# EAGLE design in-14driver (EAGLE 9.5.2)
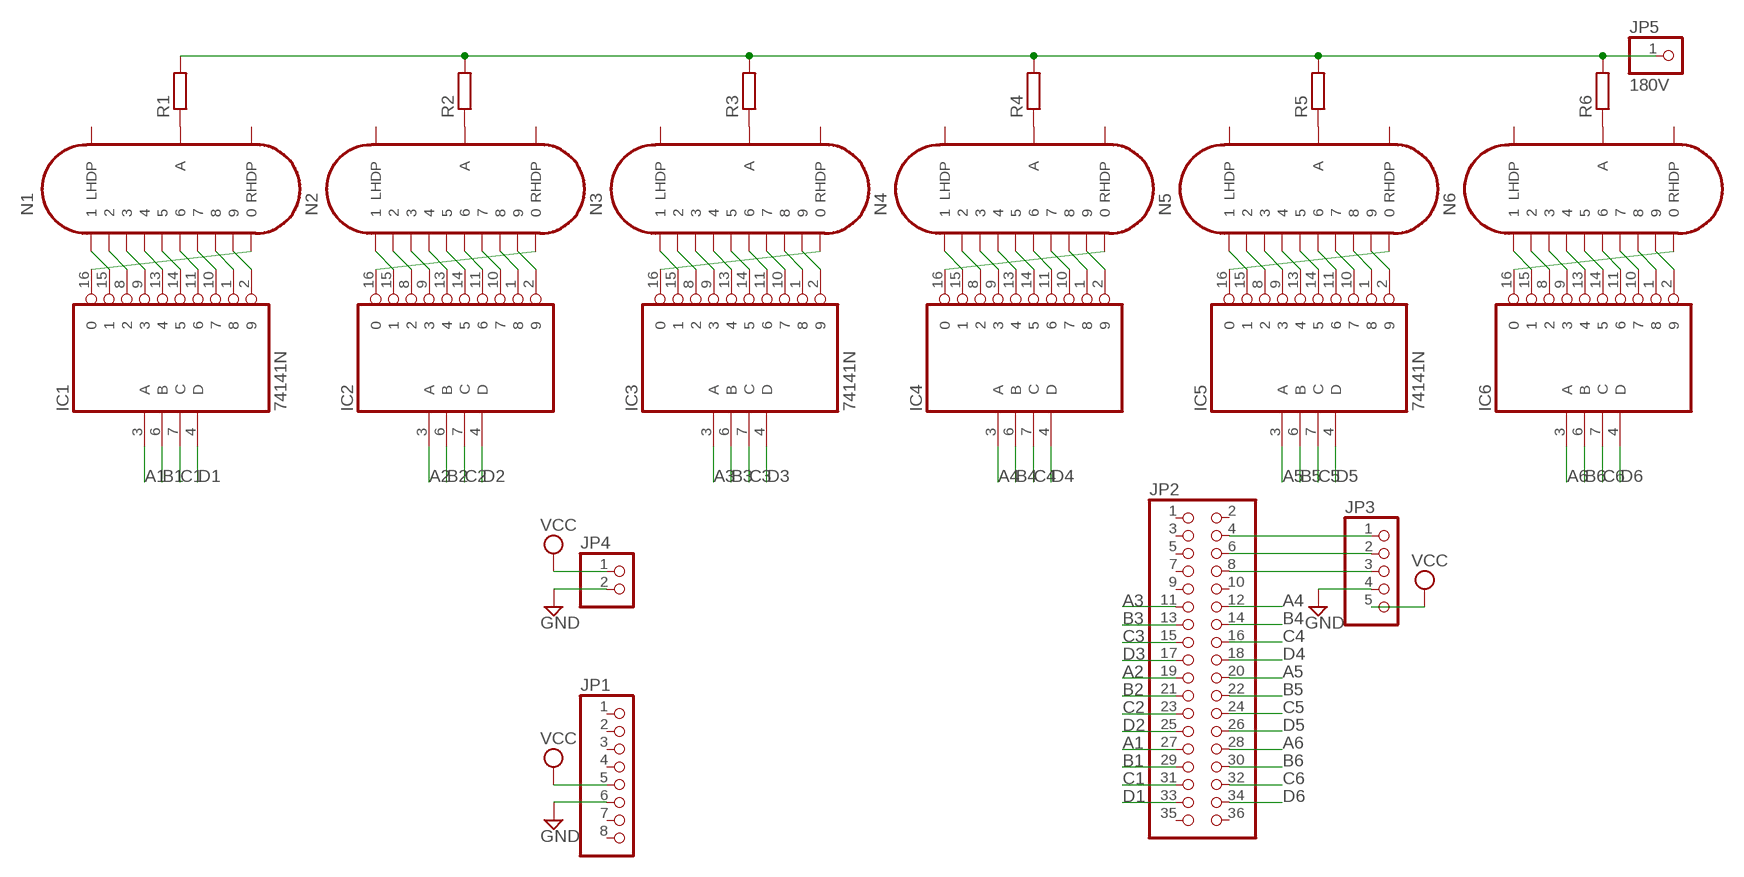
[diagram p0: schematic, sheet 1]

## Parts
IC1  74141N  [DIL16]
IC2  74141N  [DIL16]
IC3  74141N  [DIL16]
IC4  74141N  [DIL16]
IC5  74141N  [DIL16]
IC6  74141N  [DIL16]
JP1  PINHD-1X8  [1X08]
JP2  PINHD-2X18  [2X18]
JP3  PINHD-1X5  [1X05]
JP4  PINHD-1X2  [1X02]
JP5  180V  PINHD-1X1  [1X01]
N1  IN-14  [IN-14]
N2  IN-14  [IN-14]
N3  IN-14  [IN-14]
N4  IN-14  [IN-14]
N5  IN-14  [IN-14]
N6  IN-14  [IN-14]
R1  R-EU_0207/10  [0207/10]
R2  R-EU_0207/10  [0207/10]
R3  R-EU_0207/10  [0207/10]
R4  R-EU_0207/10  [0207/10]
R5  R-EU_0207/10  [0207/10]
R6  R-EU_0207/10  [0207/10]

## Nets
A1: IC1.3(A) JP2.27
A2: IC2.3(A) JP2.19
A3: IC3.3(A) JP2.11
A4: IC4.3(A) JP2.12
A5: IC5.3(A) JP2.20
A6: IC6.3(A) JP2.28
B1: IC1.6(B) JP2.29
B2: IC2.6(B) JP2.21
B3: IC3.6(B) JP2.13
B4: IC4.6(B) JP2.14
B5: IC5.6(B) JP2.22
B6: IC6.6(B) JP2.30
C1: IC1.7(C) JP2.31
C2: IC2.7(C) JP2.23
C3: IC3.7(C) JP2.15
C4: IC4.7(C) JP2.16
C5: IC5.7(C) JP2.24
C6: IC6.7(C) JP2.32
D1: IC1.4(D) JP2.33
D2: IC2.4(D) JP2.25
D3: IC3.4(D) JP2.17
D4: IC4.4(D) JP2.18
D5: IC5.4(D) JP2.26
D6: IC6.4(D) JP2.34
GND: JP1.6 JP3.4 JP4.2
N$1: IC2.15 N2.0
N$2: IC2.8 N2.9
N$3: IC2.9 N2.8
N$4: IC2.13 N2.7
N$5: IC2.14 N2.6
N$6: IC2.11 N2.5
N$7: IC2.10 N2.4
N$8: IC2.1 N2.3
N$9: IC2.2 N2.2
N$10: IC2.16 N2.1
N$11: N2.A R2.1
N$12: IC3.15 N3.0
N$13: IC3.8 N3.9
N$14: IC3.9 N3.8
N$15: IC3.13 N3.7
N$16: IC3.14 N3.6
N$17: IC3.11 N3.5
N$18: IC3.10 N3.4
N$19: IC3.1 N3.3
N$20: IC3.2 N3.2
N$21: JP2.4 JP3.1
N$22: JP2.6 JP3.2
N$23: JP2.8 JP3.3
N$29: IC3.16 N3.1
N$30: N3.A R3.1
N$31: IC4.15 N4.0
N$32: IC4.8 N4.9
N$33: IC4.9 N4.8
N$34: IC4.13 N4.7
N$35: IC4.14 N4.6
N$36: IC4.11 N4.5
N$37: IC4.10 N4.4
N$38: IC4.1 N4.3
N$39: IC4.2 N4.2
N$40: IC4.16 N4.1
N$41: N4.A R4.1
N$42: IC5.15 N5.0
N$43: IC5.8 N5.9
N$44: IC5.9 N5.8
N$45: IC5.13 N5.7
N$46: IC5.14 N5.6
N$47: IC5.11 N5.5
N$48: IC5.10 N5.4
N$57: IC1.15 N1.0
N$58: IC1.8 N1.9
N$59: IC1.9 N1.8
N$60: IC1.13 N1.7
N$61: IC1.14 N1.6
N$62: IC1.11 N1.5
N$63: IC1.10 N1.4
N$64: IC1.1 N1.3
N$65: IC1.2 N1.2
N$66: IC1.16 N1.1
N$67: IC5.1 N5.3
N$68: IC5.2 N5.2
N$69: IC5.16 N5.1
N$70: N5.A R5.1
N$71: IC6.15 N6.0
N$72: IC6.8 N6.9
N$73: IC6.9 N6.8
N$74: IC6.13 N6.7
N$75: IC6.14 N6.6
N$76: IC6.11 N6.5
N$94: N1.A R1.1
N$95: IC6.10 N6.4
N$96: IC6.1 N6.3
N$97: IC6.2 N6.2
N$98: IC6.16 N6.1
N$99: N6.A R6.1
VCC: JP1.5 JP3.5 JP4.1
VH: JP5.1 R1.2 R2.2 R3.2 R4.2 R5.2 R6.2
Unconnected: JP1.1 JP1.2 JP1.3 JP1.4 JP1.7 JP1.8 JP2.1 JP2.2 JP2.3 JP2.5 JP2.7 JP2.9 JP2.10 JP2.35 JP2.36 N1.LHDP N1.RHDP N2.LHDP N2.RHDP N3.LHDP N3.RHDP N4.LHDP N4.RHDP N5.LHDP N5.RHDP N6.LHDP N6.RHDP

## Power pins joined to a net without a drawn wire
GND: IC1.12(GND) IC2.12(GND) IC3.12(GND) IC4.12(GND) IC5.12(GND) IC6.12(GND)
VCC: IC1.5(VCC) IC2.5(VCC) IC3.5(VCC) IC4.5(VCC) IC5.5(VCC) IC6.5(VCC)

## Library data of the parts
IC1-IC6 = 74xx-us:74*141: BCD to decimal DECODER/DRIVER
JP1 = pinhead:PINHD-1X8: PIN HEADER
JP2 = pinhead:PINHD-2X18: PIN HEADER
JP3 = pinhead:PINHD-1X5: PIN HEADER
JP4 = pinhead:PINHD-1X2: PIN HEADER
JP5 = pinhead:PINHD-1X1: PIN HEADER
N1-N6 = russian-nixies:IN-14: IN-14: medium numeric frontview nixie tube
R1-R6 = rcl:R-EU_: RESISTOR, European symbol; SPICEPREFIX: R

## Board
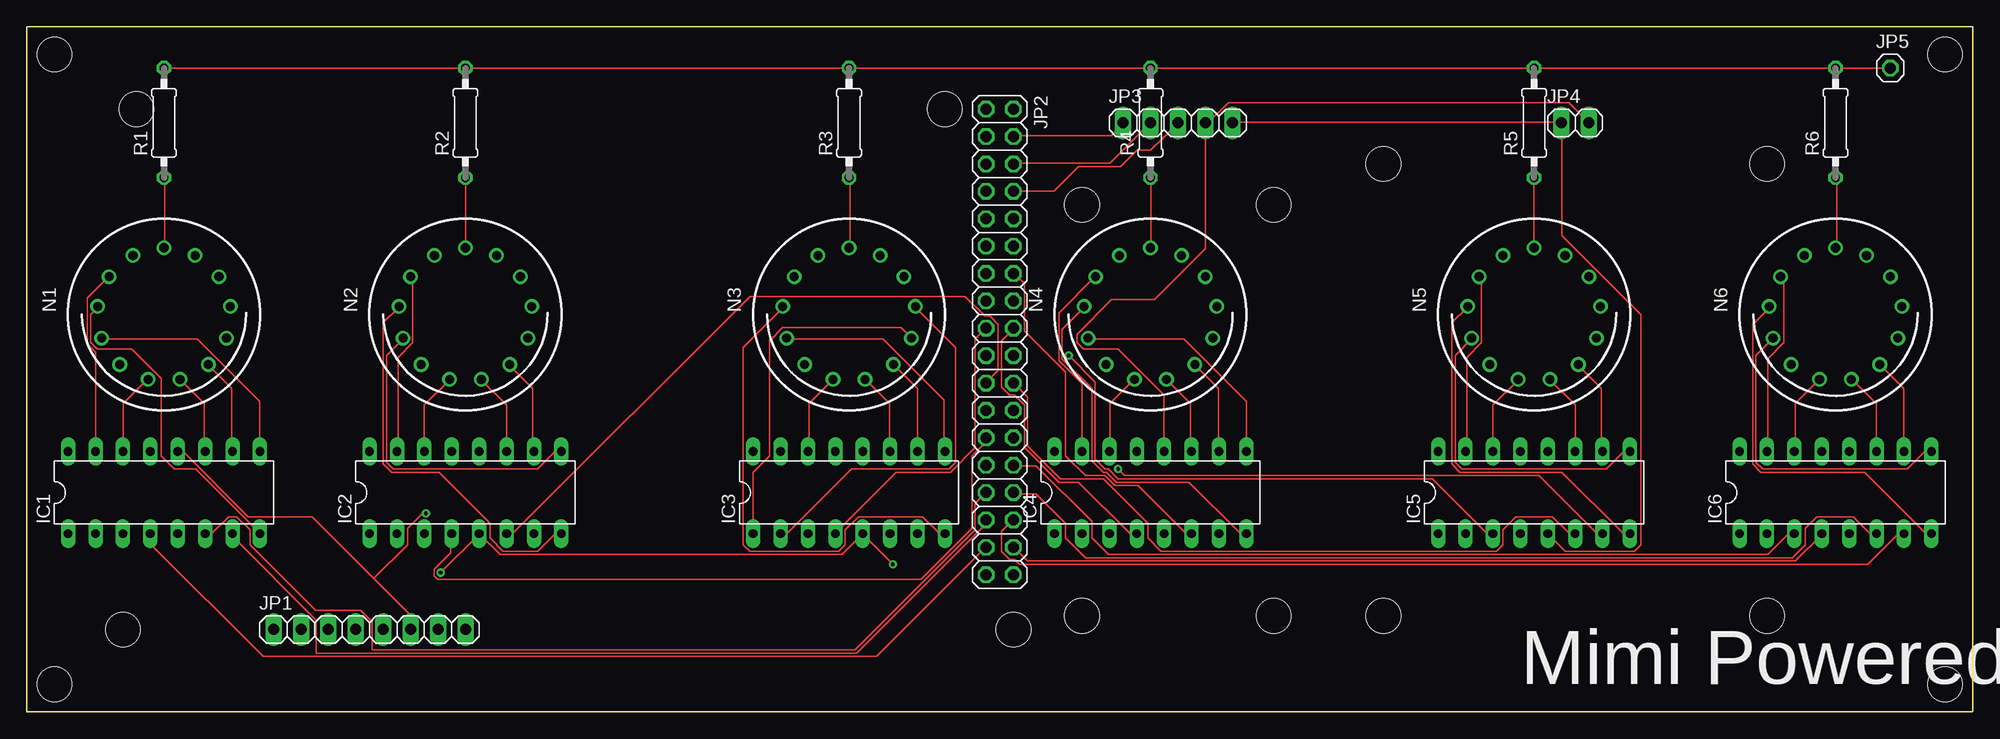
[diagram p1: board, top side]
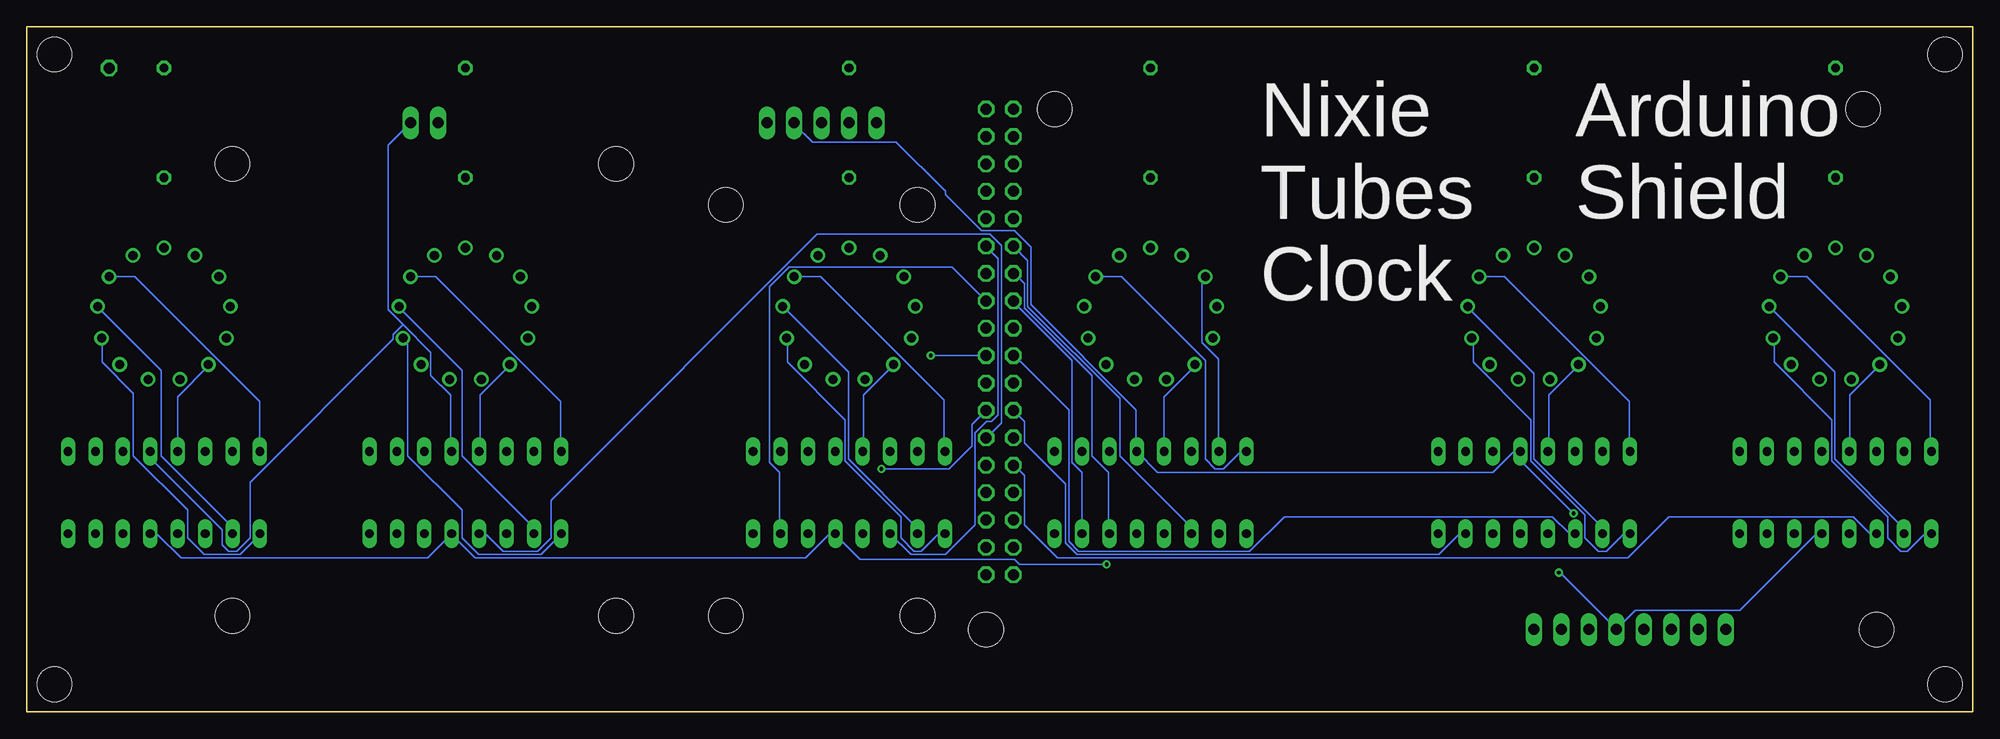
[diagram p2: board, bottom side, seen from below]

Size 180.34 x 63.5 mm. Coordinates in mm from the lower left corner, seen from the top.
Outline: 0,0 0,63.5 180.34,63.5 180.34,0 0,0
Copper layers (1*16): Top 0.035mm / dielectric 1.5mm / Bottom 0.035mm
Design rules "default *": minimum track width 6mil, minimum drill 0.35mm, track to track 6mil, track to pad 6mil, pad to pad 6mil, via to via 6mil, smd to smd 6mil, copper to edge 40mil, drill to drill 6mil, minimum pad ring 10mil, minimum via ring 8mil, stop-mask expansion 4mil, vias tented up to drill 0mil, thermal gap 10mil
Holes 3.2 mm at 10.16,55.88 85.09,55.88 8.89,7.62 91.44,7.62 2.54,60.96 2.54,2.54 177.8,60.96 177.8,2.54 161.29,50.8 161.29,8.89 125.73,8.89 125.73,50.8 115.57,8.89 115.57,46.99 97.79,8.89 97.79,46.99

### Footprints (pad centres in the part's own frame; a part is rotated, then mirrored left to right if it is on the bottom)
DIL16 = drill 0.813 long: 1 -8.89,-3.81; 2 -6.35,-3.81; 3 -3.81,-3.81; 4 -1.27,-3.81; 5 1.27,-3.81; 6 3.81,-3.81; 7 6.35,-3.81; 8 8.89,-3.81; 9 8.89,3.81; 10 6.35,3.81; 11 3.81,3.81; 12 1.27,3.81; 13 -1.27,3.81; 14 -3.81,3.81; 15 -6.35,3.81; 16 -8.89,3.81
1X08 = drill 1.016 long: 1 -8.89,0; 2 -6.35,0; 3 -3.81,0; 4 -1.27,0; 5 1.27,0; 6 3.81,0; 7 6.35,0; 8 8.89,0
2X18 = drill 1.016 octagon: 1 -21.59,-1.27; 2 -21.59,1.27; 3 -19.05,-1.27; 4 -19.05,1.27; 5 -16.51,-1.27; 6 -16.51,1.27; 7 -13.97,-1.27; 8 -13.97,1.27; 9 -11.43,-1.27; 10 -11.43,1.27; 11 -8.89,-1.27; 12 -8.89,1.27; 13 -6.35,-1.27; 14 -6.35,1.27; 15 -3.81,-1.27; 16 -3.81,1.27; 17 -1.27,-1.27; 18 -1.27,1.27; 19 1.27,-1.27; 20 1.27,1.27; 21 3.81,-1.27; 22 3.81,1.27; 23 6.35,-1.27; 24 6.35,1.27; 25 8.89,-1.27; 26 8.89,1.27; 27 11.43,-1.27; 28 11.43,1.27; 29 13.97,-1.27; 30 13.97,1.27; 31 16.51,-1.27; 32 16.51,1.27; 33 19.05,-1.27; 34 19.05,1.27; 35 21.59,-1.27; 36 21.59,1.27
1X05 = drill 1.016 long: 1 -5.08,0; 2 -2.54,0; 3 0,0; 4 2.54,0; 5 5.08,0
1X02 = drill 1.016 long: 1 -1.27,0; 2 1.27,0
1X01 = drill 1.016 octagon: 1 0,0
IN-14 = drill 0.84: 0 5.094,-3.516; 1 -5.094,-3.516; 2 -6.145,-0.746; 3 -5.788,2.195; 4 -4.105,4.633; 5 -1.481,6.01; 6 1.481,6.01; 7 4.105,4.633; 8 5.788,2.195; 9 6.145,-0.746; A 0,-6.19; LHDP 2.877,-5.481; RHDP -2.877,-5.481
0207/10 = drill 0.813 octagon: 1 -5.08,0; 2 5.08,0

### Placement (x,y rotation side)
IC1  12.7,20.32 0 top
IC2  40.64,20.32 0 top
IC3  76.2,20.32 0 top
IC4  104.14,20.32 0 top
IC5  139.7,20.32 0 top
IC6  167.64,20.32 0 top
JP1  31.75,7.62 0 top
JP2  90.17,34.29 270 top
JP3  106.68,54.61 0 top
JP4  143.51,54.61 0 top
JP5  172.72,59.69 0 top
N1  12.7,36.83 180 top
N2  40.64,36.83 180 top
N3  76.2,36.83 180 top
N4  104.14,36.83 180 top
N5  139.7,36.83 180 top
N6  167.64,36.83 180 top
R1  12.7,54.61 90 top
R2  40.64,54.61 90 top
R3  76.2,54.61 90 top
R4  104.14,54.61 90 top
R5  139.7,54.61 90 top
R6  167.64,54.61 90 top

### Tracks (layer width: path | path; a pad name or v marks a point on that pad's centre or on a via)
A1
  Bottom 0.152: IC1.3 8.94,16.56 9.55,16.56 11.07,18.09 28.14,18.09 31.95,14.27 84.84,14.27 87.88,17.32 87.88,21.89 88.8,22.81 JP2.27
A2
  Bottom 0.152: IC2.3 36.83,16.56 37.44,16.56 38.96,18.09 63.81,18.09 67,14.88 82.86,14.88 83.77,15.8 83.77,27.99 88.8,33.02 JP2.19
A3
  Bottom 0.152: JP2.11 87.58,41.86 87.58,37.59 79.05,29.06 79.05,23.72 72.49,17.17 72.49,16.56 IC3.3
A4
  Bottom 0.152: IC4.3 98.4,14.58 95.2,14.58 92.46,17.32 92.46,25.86 91.39,26.92 90.93,26.92 90.32,27.53 90.32,42.01 91.39,43.08 JP2.12
A5  (via drill 0.35)
  Top 0.152: v96.57,33.02 99.01,30.58 99.01,23.42 99.92,22.5 100.23,22.5 101.14,21.59 130.25,21.59 135.28,16.56 135.89,16.56 IC5.3
  Bottom 0.152: JP2.20 v96.57,33.02
A6
  Top 0.152: IC6.3 163.78,16.41 163.17,16.41 161.34,14.58 100.23,14.58 98.7,16.1 98.7,17.63 93.52,22.81 91.54,22.81 JP2.28
B1
  Top 0.152: JP2.29 87.88,19.3 87.88,16.87 76.76,5.74 32,5.74 32,8.33 30.94,9.4 26.77,9.4 20.68,15.49 20.68,16.87 19.46,18.09 18.69,18.09 17.17,16.56 16.56,16.56 IC1.6
B2
  Top 0.152: IC2.6 44.45,16.56 45.06,16.56 67,38.51 86.97,38.51 88.8,36.68 89.26,36.68 90.02,35.92 90.02,31.65 88.95,30.58 JP2.21
B3
  Bottom 0.152: IC3.6 80.11,16.56 80.11,22.2 81.64,23.72 81.64,31.19 87.88,37.44 87.88,39.73 88.8,40.64 JP2.13
B4
  Top 0.152: IC4.6 107.85,16.56 107.39,16.56 102.97,20.98 100.84,20.98 99.92,21.89 98.09,21.89 96.27,23.72 96.27,31.5 92.46,35.31 92.46,39.73 91.54,40.64 JP2.14
B5
  Top 0.152: IC5.6 143.51,16.56 142.9,16.56 141.38,18.09 138.02,18.09 136.8,16.87 136.8,15.49 136.19,14.88 105.11,14.88 103.89,16.1 103.89,17.47 99.77,21.59 95.81,21.59 92.76,24.64 92.76,29.21 91.54,30.43 JP2.22
B6
  Top 0.152: IC6.6 171.4,16.56 170.79,16.56 169.27,18.09 165.91,18.09 164.85,17.02 164.85,15.49 163.63,14.27 98.09,14.27 96.27,16.1 96.27,17.47 93.52,20.22 91.54,20.22 JP2.30
C1
  Top 0.152: IC1.7 19.15,16.41 19.15,16.15 26.82,8.48 26.82,5.44 76.91,5.44 88.8,17.32 88.8,17.78 JP2.31
C2
  Bottom 0.152: JP2.23 87.88,26.92 87.88,24.94 84.07,21.13 84.07,15.65 83.01,14.58 49.48,14.58 47.65,16.41 47.04,16.41 IC2.7
C3
  Bottom 0.152: IC3.7 82.55,22.2 83.46,23.11 83.46,32.56 88.95,38.05 JP2.15
C4
  Bottom 0.152: JP2.16 94.59,41.25 109.68,41.25 111.51,39.42 111.51,23.11 110.59,22.2 110.59,16.56 IC4.7
C5  (via drill 0.35)
  Top 0.152: v101.14,22.5 101.75,21.89 140.16,21.89 145.49,16.56 145.95,16.56 IC5.7
  Bottom 0.152: v101.14,22.5 94.89,22.5 92.76,24.64 92.76,26.62 JP2.24
C6
  Top 0.152: IC6.7 173.99,16.41 173.38,16.41 170.64,13.66 92,13.66 91.54,14.12 91.08,14.12 90.32,14.88 90.32,16.71 91.39,17.78 JP2.32
D1
  Top 0.152: IC1.4 11.53,16.41 11.53,15.49 21.9,5.13 78.74,5.13 88.8,15.19 JP2.33
D2
  Top 0.152: IC2.4 39.27,16.41 39.27,14.73 37.74,13.21 37.74,12.6 38.05,12.29 82.86,12.29 87.58,17.02 87.58,23.72 88.8,24.94 88.8,25.4 JP2.25
D3
  Top 0.152: JP2.17 87.88,34.54 87.88,24.49 85.6,22.2 80.57,22.2 74.93,16.56 IC3.4
D4
  Top 0.152: IC4.4 102.82,16.56 102.21,16.56 97.48,21.29 95.66,21.29 92.46,24.49 92.46,28.45 91.54,29.36 91.08,29.36 90.32,30.12 90.32,34.39 91.39,35.46 JP2.18
D5
  Bottom 0.152: IC5.4 138.33,16.41 137.72,16.41 136.19,14.88 132.99,14.88 131.77,16.1 131.77,19.61 107.09,44.3 91.08,44.3 90.02,43.23 90.02,26.77 91.39,25.4 JP2.26
D6
  Top 0.152: IC6.4 166.37,16.41 163.93,13.97 92.76,13.97 91.54,15.19 JP2.34
GND  (via drill 0.35)
  Top 0.152: JP1.6 35.56,8.94 32.16,12.34 | 32.16,12.34 26.42,18.09 20.52,18.09 14.58,24.03 13.97,24.03 IC1.12 | v36.98,18.39 36.68,18.39 35.31,17.02 35.31,15.49 32.16,12.34 | IC4.12 105.41,29.36 101.14,33.63 97.94,33.63 97.33,34.24 97.33,35 100.53,38.2 104.5,38.2 109.22,42.93 JP3.4 109.22,54.66 109.53,54.66 111.35,56.49 142.9,56.49 JP4.2
  Bottom 0.152: v36.98,18.39 41.86,23.27 41.86,24.03 IC2.12 42.01,24.03 42.62,24.03 44.45,22.2 75.54,22.2 IC3.12 77.52,24.18 77.52,27.99 87.27,37.74 87.27,43.08 88.8,44.6 91.85,44.6 95.2,47.95 95.2,48.26 99.77,52.83 107.54,52.83 109.22,54.51 JP3.4 | 145.49,35.92 146.86,37.29 146.86,52.53 JP4.2 | 145.49,35.92 142.9,33.33 142.9,31.19 141.07,29.36 141.07,24.18 IC5.12 | 145.49,35.92 146.41,35 146.41,34.54 159.66,21.29 159.66,16.1 160.88,14.88 161.65,14.88 162.25,15.49 162.25,16.87 168.81,23.42 168.81,24.03 IC6.12
N$1
  Top 0.152: IC2.15 34.39,24.18 34.39,32.87 35.76,34.24 35.76,40.18 35.61,40.34 N2.0
N$2
  Top 0.152: IC2.8 49.48,16.41 48.87,16.41 47.35,14.88 44.15,14.88 42.93,16.1 42.93,17.47 38.2,22.2 33.78,22.2 33.02,22.96 33.02,36.07 34.39,37.44 N2.9
N$3
  Top 0.152: IC2.9 49.48,24.03 48.87,24.03 47.35,22.5 33.93,22.5 33.33,23.11 33.33,33.02 34.85,34.54 N2.8
N$4
  Bottom 0.152: IC2.13 39.27,24.18 39.27,29.36 36.52,32.11 N2.7
N$5
  Top 0.152: IC2.14 36.83,28.45 39.12,30.73 N2.6
N$6
  Top 0.152: IC2.11 44.45,28.45 42.16,30.73 N2.5
N$7
  Top 0.152: IC2.10 46.89,24.18 46.89,29.97 44.76,32.11 N2.4
N$8
  Bottom 0.152: IC2.1 31.8,16.41 32.41,16.41 33.93,14.88 34.7,14.88 35.92,16.1 35.92,18.24 40.95,23.27 40.95,27.08 46.28,32.41 46.28,34.54 N2.3
N$9
  Bottom 0.152: IC2.2 34.39,16.56 34.39,17.17 40.64,23.42 40.64,31.34 46.74,37.44 N2.2
N$10
  Bottom 0.152: IC2.16 31.8,24.18 31.8,28.75 43.38,40.34 45.67,40.34 N2.1
N$11
  Top 0.152: N2.A R2.1
N$12
  Bottom 0.152: IC3.15 69.9,24.18 69.9,32.71 71.42,34.24 71.42,40.03 71.12,40.34 N3.0
N$13
  Top 0.152: IC3.8 84.99,16.56 84.53,16.56 83.01,18.09 77.06,18.09 75.84,16.87 75.84,15.49 75.23,14.88 67,14.88 66.4,15.49 66.4,33.78 70.05,37.44 N3.9
N$14
  Top 0.152: IC3.9 84.99,24.18 84.99,28.91 79.35,34.54 70.51,34.54 N3.8
N$15
  Bottom 0.152: IC3.13 74.93,29.21 72.03,32.11 N3.7
N$16
  Top 0.152: IC3.14 72.49,24.18 72.49,28.6 74.62,30.73 N3.6
N$17
  Top 0.152: IC3.11 79.96,24.18 79.96,28.6 77.83,30.73 N3.5
N$18
  Top 0.152: IC3.10 82.55,29.97 80.42,32.11 N3.4
N$19
  Top 0.152: IC3.1 67.31,22.2 68.83,23.72 68.83,34.39 70.05,35.61 81.03,35.61 81.94,34.7 N3.3
N$20
  Top 0.152: IC3.2 69.9,16.56 70.51,16.56 76.45,22.5 85.45,22.5 86.06,23.11 86.06,33.78 82.4,37.44 N3.2
N$21
  Top 0.152: JP2.4 91.54,53.44 100.53,53.44 101.6,54.51 JP3.1
N$22
  Top 0.152: JP3.2 100.38,50.85 91.54,50.85 JP2.6
N$23
  Top 0.152: JP2.8 95.2,48.26 97.48,50.55 101.4,50.55 101.4,50.6 102.87,52.07 104.14,52.07 106.63,54.51 JP3.3
N$29
  Bottom 0.152: IC3.16 67.31,24.03 67.92,24.03 69.44,22.5 70.21,22.5 71.12,23.42 71.12,32.56 78.89,40.34 81.18,40.34 N3.1
N$30
  Top 0.152: R3.1 76.3,49.48 76.3,43.08 N3.A
N$31
  Top 0.152: IC4.15 97.79,30.43 95.66,32.56 95.66,36.98 99.01,40.34 N4.0
N$32
  Top 0.152: IC4.8 113.03,16.56 112.42,16.56 107.7,21.29 100.99,21.29 100.08,22.2 99.77,22.2 98.7,23.27 98.7,29.97 95.96,32.71 95.96,35.46 97.94,37.44 N4.9
N$33
  Top 0.152: IC4.9 113.03,28.75 107.24,34.54 98.4,34.54 N4.8
N$34
  Bottom 0.152: IC4.13 102.82,24.18 102.82,29.36 100.08,32.11 N4.7
N$35
  Top 0.152: IC4.14 100.38,24.18 100.38,28.6 102.51,30.73 N4.6
N$36
  Top 0.152: IC4.11 107.85,24.18 107.85,28.6 105.72,30.73 N4.5
N$37
  Top 0.152: IC4.10 110.44,24.18 110.44,29.97 108.31,32.11 N4.4
N$38
  Bottom 0.152: IC4.1 95.35,16.41 95.96,16.41 97.48,14.88 98.09,14.88 99.31,16.1 99.31,18.09 104.5,23.27 104.5,27.08 109.83,32.41 109.83,34.54 N4.3
N$39
  Bottom 0.152: IC4.2 97.79,17.02 104.19,23.42 104.19,31.5 110.13,37.44 N4.2
N$40
  Bottom 0.152: IC4.16 95.35,24.18 95.35,28.91 106.78,40.34 109.22,40.34 N4.1
N$41
  Top 0.152: R4.1 104.19,49.48 104.19,43.08 N4.A
N$42
  Top 0.152: IC5.15 133.45,24.18 133.45,32.87 134.82,34.24 134.82,40.18 134.67,40.34 N5.0
N$43
  Top 0.152: IC5.8 148.54,16.56 147.93,16.56 142.29,22.2 132.84,22.2 132.08,22.96 132.08,36.07 133.45,37.44 N5.9
N$44
  Top 0.152: IC5.9 148.54,24.03 147.93,24.03 146.41,22.5 132.99,22.5 132.38,23.11 132.38,33.02 133.91,34.54 N5.8
N$45
  Bottom 0.152: IC5.13 138.33,24.18 138.33,29.36 135.58,32.11 N5.7
N$46
  Top 0.152: IC5.14 135.89,28.45 138.18,30.73 N5.6
N$47
  Top 0.152: IC5.11 143.51,28.45 141.22,30.73 N5.5
N$48
  Top 0.152: IC5.10 145.95,24.18 145.95,29.97 143.81,32.11 N5.4
N$57
  Top 0.152: IC1.15 6.35,33.33 5.59,34.09 5.59,38.35 7.57,40.34 N1.0
N$58
  Top 0.152: IC1.8 21.59,16.56 15.65,22.5 13.67,22.5 12.45,23.72 12.45,30.89 9.7,33.63 6.5,33.63 5.89,34.24 5.89,36.83 6.5,37.44 N1.9
N$59
  Top 0.152: IC1.9 21.59,28.75 15.8,34.54 6.96,34.54 N1.8
N$60
  Bottom 0.152: IC1.13 11.38,24.18 11.38,29.36 8.64,32.11 N1.7
N$61
  Top 0.152: IC1.14 8.94,24.18 8.94,28.6 11.07,30.73 N1.6
N$62
  Top 0.152: IC1.11 16.41,24.18 16.41,28.6 14.28,30.73 N1.5
N$63
  Top 0.152: IC1.10 19,24.18 19,29.97 16.87,32.11 N1.4
N$64
  Bottom 0.152: IC1.1 3.91,16.41 4.52,16.41 6.04,14.88 6.65,14.88 7.87,16.1 7.87,18.09 13.06,23.27 13.06,27.08 18.39,32.41 18.39,34.54 N1.3
N$65
  Bottom 0.152: IC1.2 6.35,17.02 12.75,23.42 12.75,31.5 18.69,37.44 N1.2
N$66
  Bottom 0.152: IC1.16 3.91,24.18 3.91,28.91 15.34,40.34 17.78,40.34 N1.1
N$67
  Bottom 0.152: IC5.1 130.86,16.41 132.69,14.58 138.48,14.58 140,16.1 140,18.69 145.03,23.72 145.03,34.24 145.34,34.54 N5.3
N$68
  Bottom 0.152: IC5.2 133.45,16.56 133.45,17.17 140,23.72 140,31.65 145.8,37.44 N5.2
N$69
  Bottom 0.152: IC5.16 130.86,24.18 130.86,28.75 142.44,40.34 144.73,40.34 N5.1
N$70
  Top 0.152: N5.A R5.1
N$71
  Top 0.152: IC6.15 161.34,24.18 161.34,32.71 162.86,34.24 162.86,40.03 162.56,40.34 N6.0
N$72
  Top 0.152: IC6.8 176.43,16.56 175.97,16.56 170.33,22.2 160.73,22.2 159.97,22.96 159.97,35.92 161.49,37.44 N6.9
N$73
  Top 0.152: IC6.9 176.43,24.03 175.82,24.03 174.29,22.5 160.88,22.5 160.27,23.11 160.27,33.02 161.8,34.54 N6.8
N$74
  Bottom 0.152: IC6.13 166.37,29.21 163.47,32.11 N6.7
N$75
  Top 0.152: IC6.14 163.93,24.18 163.93,28.6 166.06,30.73 N6.6
N$76
  Top 0.152: IC6.11 171.4,24.18 171.4,28.6 169.27,30.73 N6.5
N$94
  Top 0.152: R1.1 12.75,49.48 12.75,43.08 N1.A
N$95
  Top 0.152: IC6.10 173.99,29.97 171.86,32.11 N6.4
N$96
  Bottom 0.152: IC6.1 158.75,16.41 160.58,14.58 163.93,14.58 165.46,16.1 165.46,18.69 170.48,23.72 170.48,29.52 173.38,32.41 173.38,34.54 N6.3
N$97
  Bottom 0.152: IC6.2 161.34,16.56 161.34,17.17 167.89,23.72 167.89,31.65 173.68,37.44 N6.2
N$98
  Bottom 0.152: IC6.16 158.75,28.75 170.33,40.34 172.62,40.34 N6.1
N$99
  Top 0.152: R6.1 167.74,49.48 167.74,43.08 N6.A
VCC  (via drill 0.35)
  Top 0.152: v38.35,12.9 41.86,16.41 IC2.5 43.84,14.58 75.54,14.58 IC3.5 77.52,16.41 v80.26,13.66 | JP3.5 111.81,54.66 142.14,54.66 JP4.1 142.29,54.51 142.29,44.14 149.61,36.83 149.61,15.49 149,14.88 142.6,14.88 IC5.5
  Bottom 0.152: IC1.5 13.97,16.41 14.58,16.41 21.59,9.4 31.24,9.4 JP1.5 33.07,7.72 38.25,12.9 v38.35,12.9 | 105.41,16.41 106.02,16.41 108.15,14.27 138.79,14.27 140.92,16.41 IC5.5 143.2,14.27 166.06,14.27 168.2,16.41 168.81,16.41 IC6.5 | v80.26,13.66 88.34,13.66 88.8,14.12 103.12,14.12 105.41,16.41 | 105.41,16.41 IC4.5
VH
  Top 0.152: JP5.1 R6.2 R5.2 R4.2 R3.2 R2.2 R1.2

### Text on the board
tNames: Mimi Powered
bNames: Arduino / Shield | Nixie / Tubes / Clock